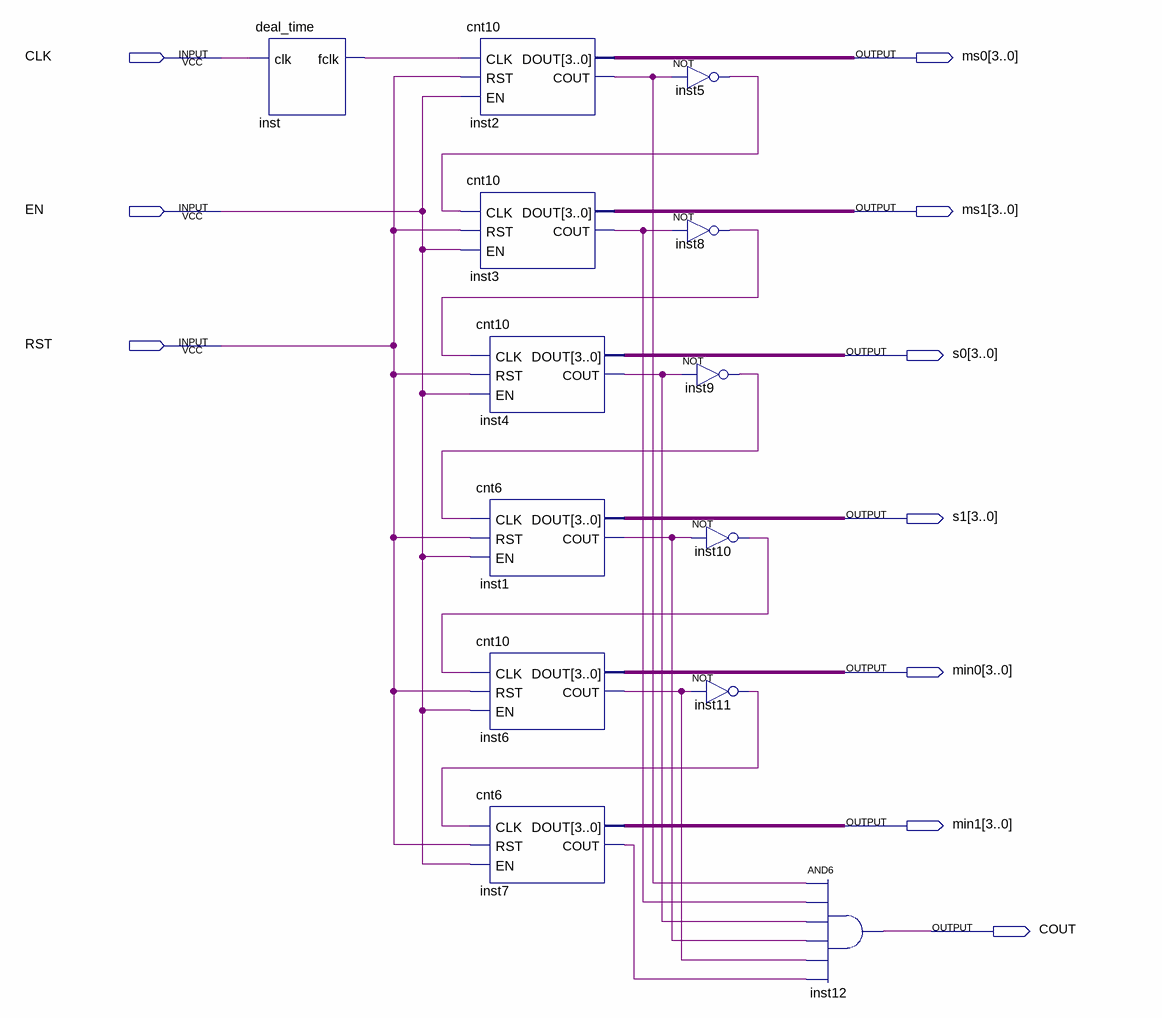
[diagram p0: schematic sheet]
// Quartus schematic clock.bdf as structural Verilog: 13 symbols, 10 pins
module clock (
  input  CLK,
  input  EN,
  input  RST,
  output [3:0] ms0,
  output [3:0] ms1,
  output [3:0] s0,
  output [3:0] s1,
  output [3:0] min0,
  output [3:0] min1,
  output COUT
);

  wire inst1_cout, inst2_cout, inst3_cout, inst4_cout, inst5_out, inst6_cout, inst7_cout, inst8_out,
       inst9_out, inst10_out, inst11_out, inst_fclk;

  deal_time inst (.clk(CLK), .fclk(inst_fclk));
  cnt10 inst2 (.CLK(inst_fclk), .RST(RST), .EN(EN), .DOUT(ms0), .COUT(inst2_cout));
  cnt10 inst3 (.CLK(inst5_out), .RST(RST), .EN(EN), .DOUT(ms1), .COUT(inst3_cout));
  cnt10 inst4 (.CLK(inst8_out), .RST(RST), .EN(EN), .DOUT(s0), .COUT(inst4_cout));
  cnt6 inst1 (.CLK(inst9_out), .RST(RST), .EN(EN), .DOUT(s1), .COUT(inst1_cout));
  cnt10 inst6 (.CLK(inst10_out), .RST(RST), .EN(EN), .DOUT(min0), .COUT(inst6_cout));
  cnt6 inst7 (.CLK(inst11_out), .RST(RST), .EN(EN), .DOUT(min1), .COUT(inst7_cout));
  not inst5 (inst5_out, inst2_cout);
  not inst8 (inst8_out, inst3_cout);
  not inst9 (inst9_out, inst4_cout);
  not inst10 (inst10_out, inst1_cout);
  not inst11 (inst11_out, inst6_cout);
  and inst12 (COUT, inst2_cout, inst3_cout, inst4_cout, inst1_cout, inst6_cout, inst7_cout);
endmodule
